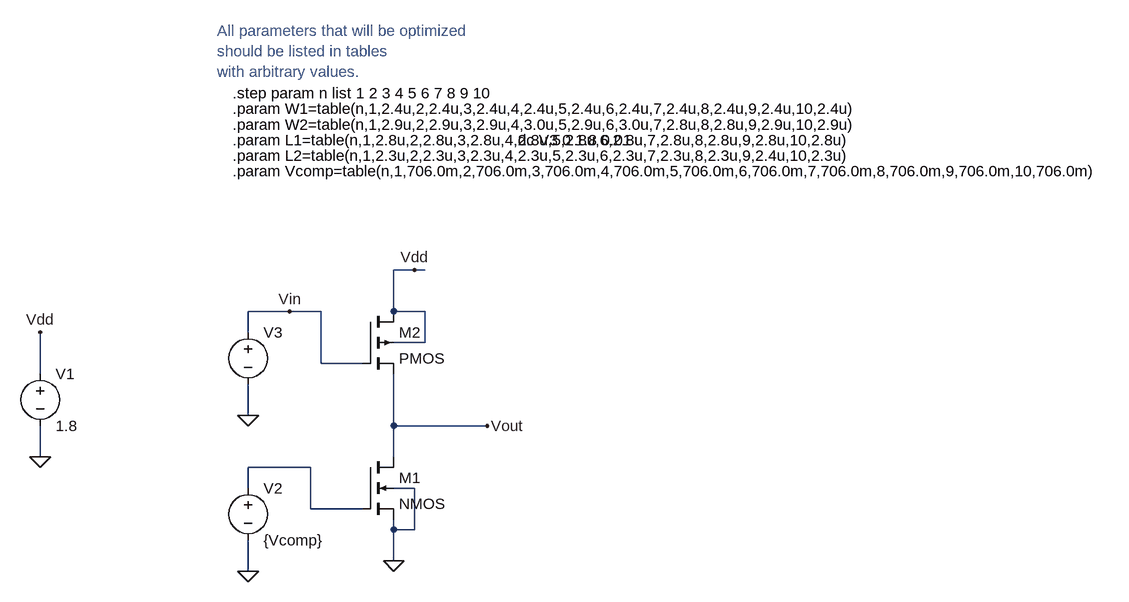
[diagram p0: schematic comparator_2.asc]
comparator_2.asc, the LTspice schematic file:
Version 4
SHEET 1 4496 2148
WIRE -80 -480 -112 -480
WIRE -64 -480 -80 -480
WIRE -272 -416 -336 -416
WIRE -224 -416 -272 -416
WIRE -112 -416 -112 -480
WIRE -64 -416 -112 -416
WIRE -336 -384 -336 -416
WIRE -64 -368 -64 -416
WIRE -64 -368 -112 -368
WIRE -224 -336 -224 -416
WIRE -160 -336 -224 -336
WIRE -656 -320 -656 -384
WIRE -336 -256 -336 -304
WIRE -112 -240 -112 -320
WIRE 32 -240 -112 -240
WIRE -656 -192 -656 -240
WIRE -112 -192 -112 -240
WIRE -240 -176 -336 -176
WIRE -336 -144 -336 -176
WIRE -80 -144 -112 -144
WIRE -240 -112 -240 -176
WIRE -160 -112 -240 -112
WIRE -112 -80 -112 -96
WIRE -80 -80 -80 -144
WIRE -80 -80 -112 -80
WIRE -112 -32 -112 -80
WIRE -336 -16 -336 -64
FLAG -656 -192 0
FLAG -80 -480 Vdd
FLAG -656 -384 Vdd
FLAG -112 -32 0
FLAG -336 -16 0
FLAG -336 -256 0
FLAG -272 -416 Vin
FLAG 32 -240 Vout
SYMBOL nmos4 -160 -192 R0
SYMATTR InstName M1
SYMATTR Value2 l={L1} w={W1} ad={W1*L1} as={W1*L1} pd={2*W1+2*L1} ps={2*W1+2*L1} m=1
SYMBOL pmos4 -160 -416 R0
SYMATTR InstName M2
SYMATTR Value2 l={L2} w={W2} ad={W2*L2} as={W2*L2} pd={2*W1+2*L1} ps={2*W1+2*L1} m=1
SYMBOL voltage -656 -336 R0
WINDOW 123 0 0 Left 0
WINDOW 39 0 0 Left 0
SYMATTR InstName V1
SYMATTR Value 1.8
SYMBOL voltage -336 -160 R0
WINDOW 123 0 0 Left 0
WINDOW 39 0 0 Left 0
SYMATTR InstName V2
SYMATTR Value {Vcomp}
SYMBOL voltage -336 -400 R0
WINDOW 123 0 0 Left 0
WINDOW 39 0 0 Left 0
SYMATTR InstName V3
SYMATTR Value ""
TEXT -360 -752 Left 2 !.step param n list 1 2 3 4 5 6 7 8 9 10 
TEXT -360 -728 Left 2 !.param W1=table(n,1,2.4u,2,2.4u,3,2.4u,4,2.4u,5,2.4u,6,2.4u,7,2.4u,8,2.4u,9,2.4u,10,2.4u)
TEXT -360 -704 Left 2 !.param W2=table(n,1,2.9u,2,2.9u,3,2.9u,4,3.0u,5,2.9u,6,3.0u,7,2.8u,8,2.8u,9,2.9u,10,2.9u)
TEXT -360 -632 Left 2 !.param Vcomp=table(n,1,706.0m,2,706.0m,3,706.0m,4,706.0m,5,706.0m,6,706.0m,7,706.0m,8,706.0m,9,706.0m,10,706.0m)
TEXT -360 -680 Left 2 !.param L1=table(n,1,2.8u,2,2.8u,3,2.8u,4,2.8u,5,2.8u,6,2.8u,7,2.8u,8,2.8u,9,2.8u,10,2.8u)
TEXT -360 -656 Left 2 !.param L2=table(n,1,2.3u,2,2.3u,3,2.3u,4,2.3u,5,2.3u,6,2.3u,7,2.3u,8,2.3u,9,2.4u,10,2.3u)
TEXT 72 -680 Left 2 !.dc V3 0 1.8 0.01
TEXT -384 -848 Left 2 ;All parameters that will be optimized\nshould be listed in tables\nwith arbitrary values.

The netlist it stands for:
* comparator_2.asc
M1 Vout N001 0 0 NMOS l={L1} w={W1} ad={W1*L1} as={W1*L1} pd={2*W1+2*L1} ps={2*W1+2*L1} m=1
M2 Vdd Vin Vout Vdd PMOS l={L2} w={W2} ad={W2*L2} as={W2*L2} pd={2*W1+2*L1} ps={2*W1+2*L1} m=1
V1 Vdd 0 1.8
V2 N001 0 {Vcomp}
V3 Vin 0
.model NMOS NMOS
.model PMOS PMOS
.lib standard.mos
.step param n list 1 2 3 4 5 6 7 8 9 10
.param W1=table(n,1,2.4u,2,2.4u,3,2.4u,4,2.4u,5,2.4u,6,2.4u,7,2.4u,8,2.4u,9,2.4u,10,2.4u)
.param W2=table(n,1,2.9u,2,2.9u,3,2.9u,4,3.0u,5,2.9u,6,3.0u,7,2.8u,8,2.8u,9,2.9u,10,2.9u)
.param Vcomp=table(n,1,706.0m,2,706.0m,3,706.0m,4,706.0m,5,706.0m,6,706.0m,7,706.0m,8,706.0m,9,706.0m,10,706.0m)
.param L1=table(n,1,2.8u,2,2.8u,3,2.8u,4,2.8u,5,2.8u,6,2.8u,7,2.8u,8,2.8u,9,2.8u,10,2.8u)
.param L2=table(n,1,2.3u,2,2.3u,3,2.3u,4,2.3u,5,2.3u,6,2.3u,7,2.3u,8,2.3u,9,2.4u,10,2.3u)
.dc V3 0 1.8 0.01
* All parameters that will be optimized
* should be listed in tables
* with arbitrary values.
.backanno
.end

* Results of the author's LTspice run, read from the files saved beside the schematic
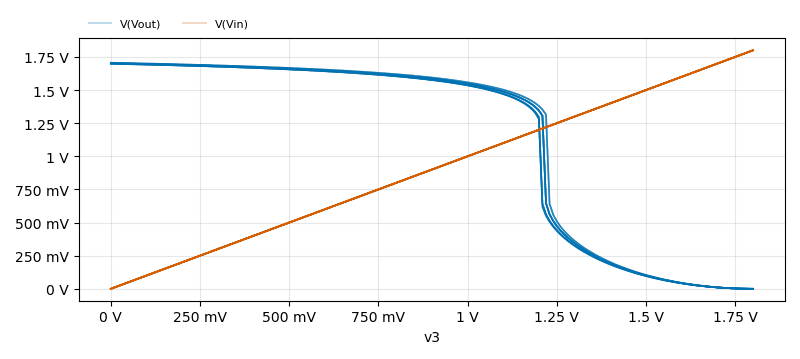
[diagram p1: DC transfer characteristic of comparator_2.asc, plotted from the saved traces]
* DC transfer characteristic, 10 runs:
*   V(Vout) [n=1]: 1.703 V at v3=0 V, 267.5 nV at v3=1.8 V, min 267.5 nV, max 1.703 V
*   V(Vout) [n=2]: 1.703 V at v3=0 V, 267.5 nV at v3=1.8 V, min 267.5 nV, max 1.703 V
*   V(Vout) [n=3]: 1.703 V at v3=0 V, 267.5 nV at v3=1.8 V, min 267.5 nV, max 1.703 V
*   V(Vout) [n=4]: 1.707 V at v3=0 V, 265.3 nV at v3=1.8 V, min 265.3 nV, max 1.707 V
*   V(Vout) [n=5]: 1.703 V at v3=0 V, 267.5 nV at v3=1.8 V, min 267.5 nV, max 1.703 V
*   V(Vout) [n=6]: 1.707 V at v3=0 V, 265.3 nV at v3=1.8 V, min 265.3 nV, max 1.707 V
*   V(Vout) [n=7]: 1.7 V at v3=0 V, 269.6 nV at v3=1.8 V, min 269.6 nV, max 1.7 V
*   V(Vout) [n=8]: 1.7 V at v3=0 V, 269.6 nV at v3=1.8 V, min 269.6 nV, max 1.7 V
*   V(Vin) [n=1]: 0 V at v3=0 V, 1.8 V at v3=1.8 V, min 0 V, max 1.8 V
*   V(Vin) [n=2]: 0 V at v3=0 V, 1.8 V at v3=1.8 V, min 0 V, max 1.8 V
*   V(Vin) [n=3]: 0 V at v3=0 V, 1.8 V at v3=1.8 V, min 0 V, max 1.8 V
*   V(Vin) [n=4]: 0 V at v3=0 V, 1.8 V at v3=1.8 V, min 0 V, max 1.8 V
*   V(Vin) [n=5]: 0 V at v3=0 V, 1.8 V at v3=1.8 V, min 0 V, max 1.8 V
*   V(Vin) [n=6]: 0 V at v3=0 V, 1.8 V at v3=1.8 V, min 0 V, max 1.8 V
*   V(Vin) [n=7]: 0 V at v3=0 V, 1.8 V at v3=1.8 V, min 0 V, max 1.8 V
*   V(Vin) [n=8]: 0 V at v3=0 V, 1.8 V at v3=1.8 V, min 0 V, max 1.8 V